# Altium schematic sheet I2C_Keypad_host_module_HID.SchDoc
size B; Author: AM; CompanyName: Expatria Technologies; DrawnBy: A.Marles; Engineer: AM; Organization: Expatria Technologies; DocumentNumber: 13; Revision: A1; SheetNumber: 13; SheetTotal: 14; PCB_Rev: A1
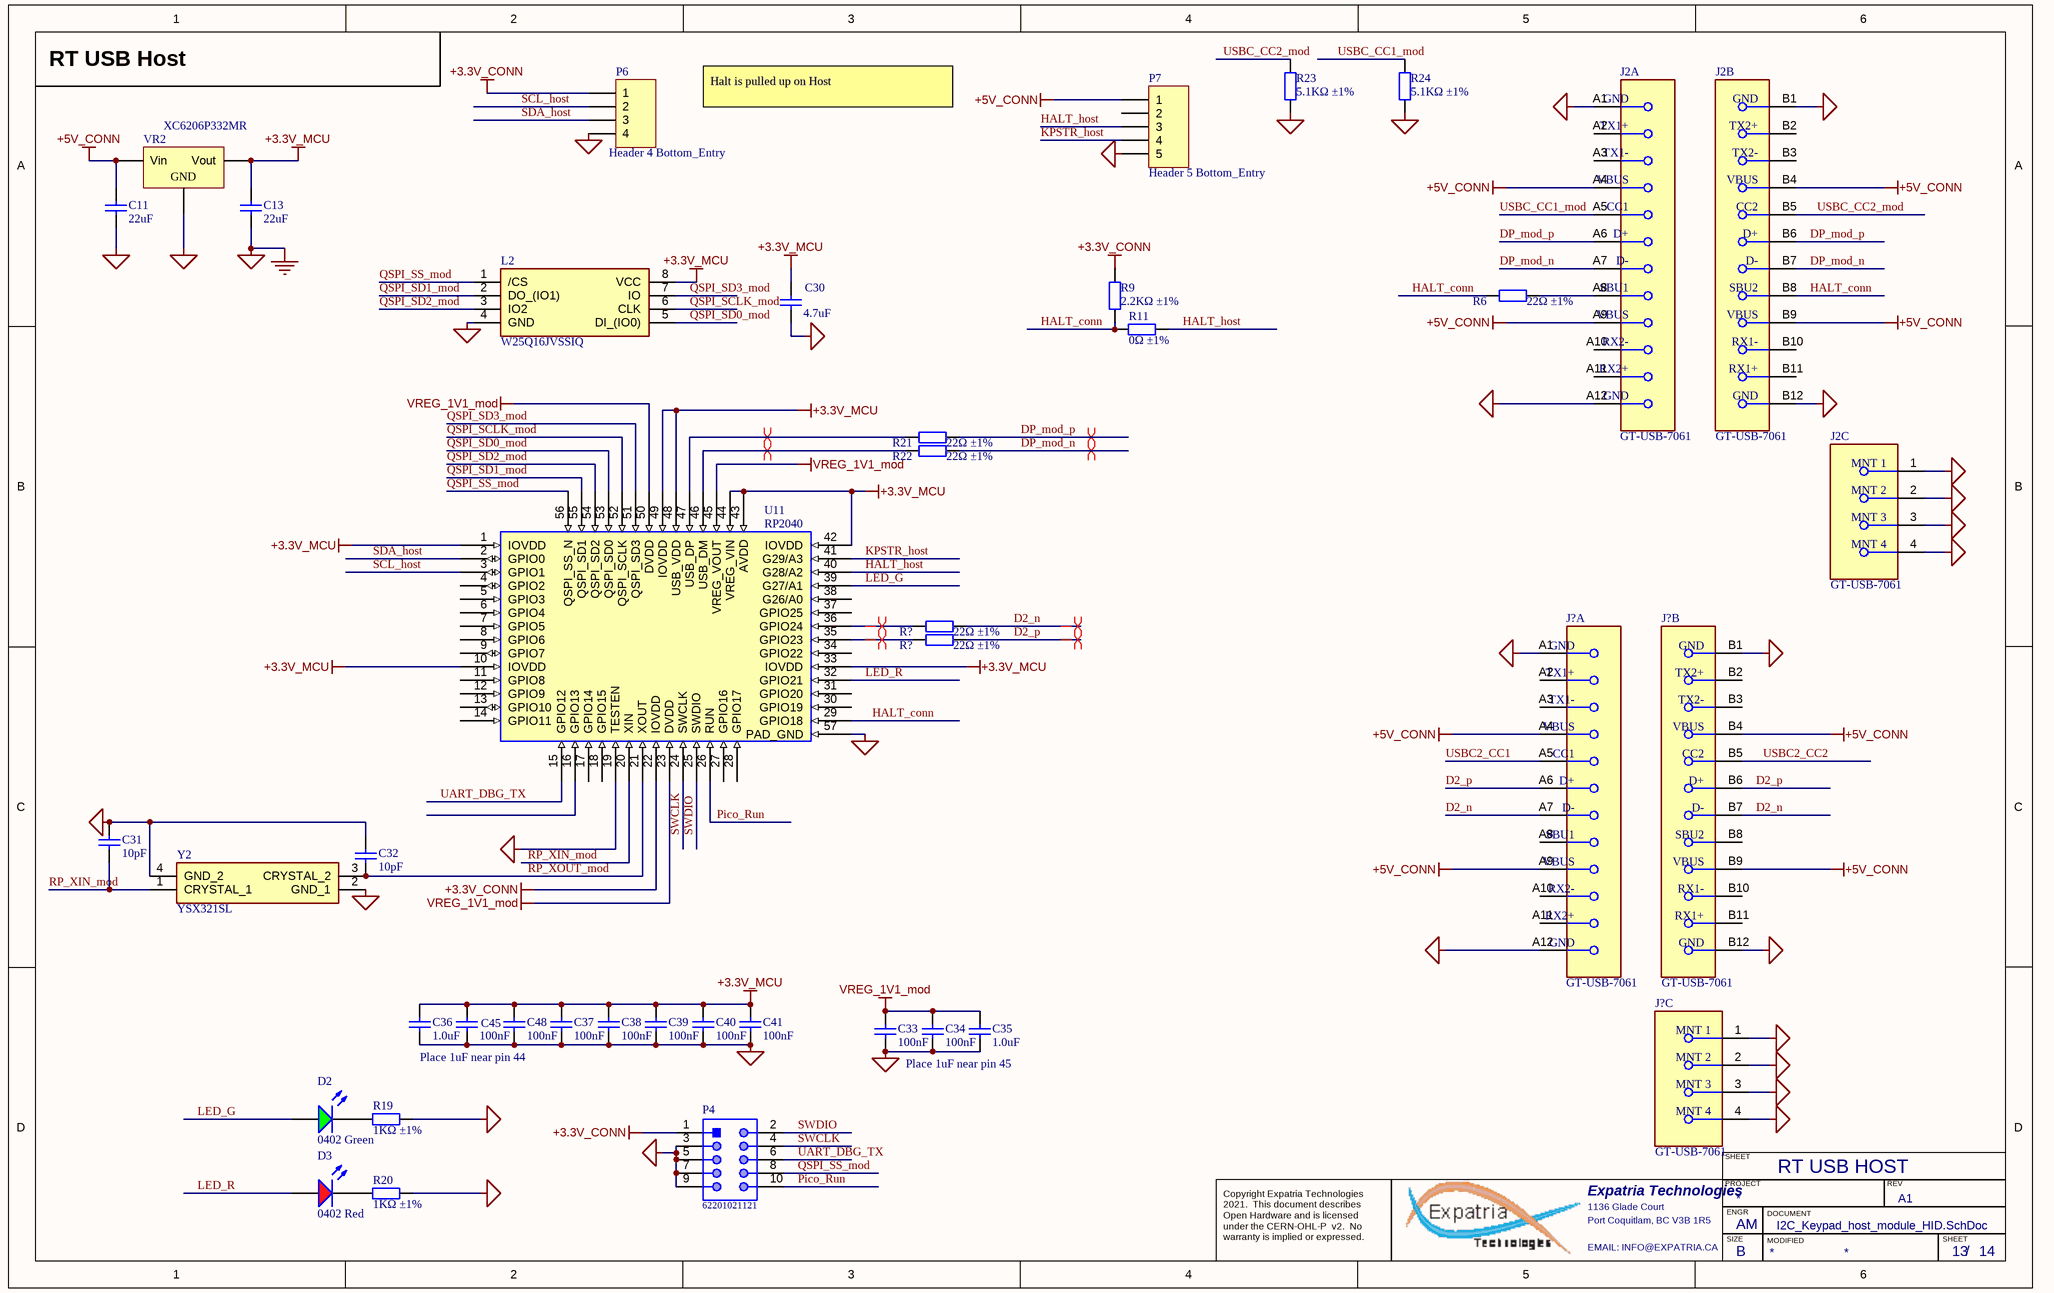
[diagram p0: I2C_Keypad_host_module_HID.SchDoc]

## Parts
(Parts that share a designator on the sheet are numbered #1, #2 ... from top to bottom, then left to right.)
C11  22uF  [0603_C]
C13  22uF  [0603_C]
C30  4.7uF  [0402_C]
C31  10pF  [0402_C]
C32  10pF  [0402_C]
C33  100nF  [0402_C]
C34  100nF  [0402_C]
C35  1.0uF  [0402_C]
C36  1.0uF  [0402_C]
C37  100nF  [0402_C]
C38  100nF  [0402_C]
C39  100nF  [0402_C]
C40  100nF  [0402_C]
C41  100nF  [0402_C]
C45  100nF  [0402_C]
C48  100nF  [0402_C]
D2  0402 Green  [LED 0402_1005 RED]
D3  0402 Red  [LED 0402_1005 RED]
J2  GT-USB-7061  [USB-C-SMD_GT-USB-7061]  (parts A,B,C of 3)
J?#1  GT-USB-7061  [USB-C-SMD_GT-USB-7061]  (part A of 3)
J?#2  GT-USB-7061  [USB-C-SMD_GT-USB-7061]  (part B of 3)
J?#3  GT-USB-7061  [USB-C-SMD_GT-USB-7061]  (part C of 3)
L2  W25Q16JVSSIQ  [SOIC127P780X195-8N]
P4  62201021121  [62201021121]  (no BOM)
P6  Header 4 Bottom_Entry  [NPTC041KFXCRC]  (no BOM)
P7  Header 5 Bottom_Entry  [NPTC051KFXCRC]  (no BOM)
R6  22Ω ±1%  [0402_R]
R9  2.2KΩ ±1%  [0603_R]
R11  0Ω ±1%  [0402_R]  (no BOM)
R19  1KΩ ±1%  [0402_R]
R20  1KΩ ±1%  [0402_R]
R21  22Ω ±1%  [0402_R]
R22  22Ω ±1%  [0402_R]
R23  5.1KΩ ±1%  [0402_R]
R24  5.1KΩ ±1%  [0402_R]
R?#1  22Ω ±1%  [0402_R]
R?#2  22Ω ±1%  [0402_R]
U11  RP2040  [RP2040]
VR2  XC6206P332MR  [SOT-23-3L]
Y2  YSX321SL  [YSX321SL]

## Nets
+3.3V_CONN: P4.1 P6.1 R9.2 U11.22(IOVDD)
+3.3V_MCU: C13.2 C30.2 C36.2 C37.2 C38.2 C39.2 C40.2 C41.2 C45.2 C48.2 L2.8(VCC) U11.1(IOVDD) U11.10(IOVDD) U11.33(IOVDD) U11.42(IOVDD) U11.43(AVDD) U11.44(VREG_VIN) U11.48(USB_VDD) U11.49(IOVDD) VR2.2(Vout)
+5V_CONN: C11.2 J2.A4(VBUS) J2.A9(VBUS) J2.B4(VBUS) J2.B9(VBUS) J?#1.A4(VBUS) J?#1.A9(VBUS) J?#2.B4(VBUS) J?#2.B9(VBUS) P7.1 VR2.3(Vin)
GND: C11.1 C13.1 VR2.1(GND)  [also labelled MCU_GND]
GND_CONN: C30.1 C31.2 C32.2 C33.1 C34.1 C35.1 C36.1 C37.1 C38.1 C39.1 C40.1 C41.1 C45.1 C48.1 J2.1(MNT_1) J2.2(MNT_2) J2.3(MNT_3) J2.4(MNT_4) J2.A1(GND) J2.A12(GND) J2.B1(GND) J2.B12(GND) J?#1.A1(GND) J?#1.A12(GND) J?#2.B1(GND) J?#2.B12(GND) J?#3.1(MNT_1) J?#3.2(MNT_2) J?#3.3(MNT_3) J?#3.4(MNT_4) L2.4(GND) P4.3 P4.5 P4.7 P4.9 P6.4 P7.5 R19.2 R20.2 R23.2 R24.2 U11.19(TESTEN) U11.57(PAD_GND) Y2.2(GND_1) Y2.4(GND_2)
VREG_1V1_mod: C33.2 C34.2 C35.2 U11.23(DVDD) U11.45(VREG_VOUT) U11.50(DVDD)
D2_n: J?#1.A7(D-) J?#2.B7(D-) R?#1.1
D2_p: J?#1.A6(D+) J?#2.B6(D+) R?#2.1
DP_mod_n: J2.A7(D-) J2.B7(D-) R22.1
DP_mod_p: J2.A6(D+) J2.B6(D+) R21.1
HALT_conn: J2.B8(SBU2) R6.2 R9.1 R11.1 U11.29(GPIO18)
HALT_host: P7.3 R11.2 U11.40(G28/A2)
KPSTR_host: P7.4 U11.41(G29/A3)
LED_G: D2.A U11.39(G27/A1)
LED_R: D3.A U11.32(GPIO21)
Pico_Run: P4.10 U11.26(RUN)
QSPI_SCLK_mod: L2.6(CLK) U11.52(QSPI_SCLK)
QSPI_SD0_mod: L2.5(DI_(IO0)) U11.53(QSPI_SD0)
QSPI_SD1_mod: L2.2(DO_(IO1)) U11.55(QSPI_SD1)
QSPI_SD2_mod: L2.3(IO2) U11.54(QSPI_SD2)
QSPI_SD3_mod: L2.7(IO) U11.51(QSPI_SD3)
QSPI_SS_mod: L2.1(/CS) P4.8 U11.56(QSPI_SS_N)
RP_XIN_mod: C31.1 U11.20(XIN) Y2.1(CRYSTAL_1)
RP_XOUT_mod: C32.1 U11.21(XOUT) Y2.3(CRYSTAL_2)
SCL_host: P6.2 U11.3(GPIO1)
SDA_host: P6.3 U11.2(GPIO0)
SWCLK: P4.4 U11.24(SWCLK)
SWDIO: P4.2 U11.25(SWDIO)
UART_DBG_TX: P4.6 U11.15(GPIO12)
USBC2_CC1: J?#1.A5(CC1)
USBC2_CC2: J?#2.B5(CC2)
USBC_CC1_mod: J2.A5(CC1) R24.1
USBC_CC2_mod: J2.B5(CC2) R23.1
NetD2_K: D2.K R19.1
NetD3_K: D3.K R20.1
NetJ2_A8: J2.A8(SBU1) R6.1
NetR21_2: R21.2 U11.47(USB_DP)
NetR22_2: R22.2 U11.46(USB_DM)
NetR?#1_2: R?#1.2 U11.36(GPIO24)
NetR?#2_2: R?#2.2 U11.35(GPIO23)

Not connected (* = marked no-connect by the designer): J2 A2(TX1+) A3(TX1-) A10(RX2-) A11(RX2+) B2(TX2+) B3(TX2-) B10(RX1-) B11(RX1+); J?#1 A2(TX1+) A3(TX1-) A8(SBU1) A10(RX2-) A11(RX2+); J?#2 B2(TX2+) B3(TX2-) B8(SBU2) B10(RX1-) B11(RX1+); P7 2; U11 4(GPIO2) 5(GPIO3) 6(GPIO4) 7(GPIO5) 8(GPIO6) 9(GPIO7) 11(GPIO8) 12(GPIO9) 13(GPIO10) 14(GPIO11) 16(GPIO13) 17(GPIO14) 18(GPIO15) 27(GPIO16) 28(GPIO17) 30(GPIO19) 31(GPIO20) 34(GPIO22) 37(GPIO25) 38(G26/A0)

## Layout directives
differential pair: D2_n, D2_p, DP_mod_n, DP_mod_p, NetR21_2, NetR22_2, NetR?#1_2, NetR?#2_2

## Notes on the sheet
- RT USB Host
- Halt is pulled up on Host
- Place 1uF near pin 44
- Place 1uF near pin 45
- RT USB HOST
- SHEET
- Expatria Technologies
- 1136 Glade Court
- Port Coquitlam, BC V3B 1R5
- PROJECT
- SIZE
- ENGR
- MODIFIED
- DOCUMENT
- REV
- Copyright Expatria Technologies 2021.  This document describes Open Hardware and is licensed under the CERN-OHL-P  v2.  No warranty is implied or expressed.
- EMAIL: INFO@EXPATRIA.CA
- B
- /

## Library data of the parts
C11 C13 = 0603 22uF (226) 20% 6.3V: Chip capacitors; Manufacturer: Samsung Electro-Mechanics; PartNumber: CL10A226MQ8NRNC; Tolerance: 20%; Voltage: 6.3V; Package: 0603; Supplier: LC; SuppliersPartNumber: C59461; Capacitance: 22uF; ComponentLink1Description: Supplier link; ComponentLink1URL: http://www.szlcsc.com/product/details_60514.html
C30 = 0402 4.7uF (475) 20% 10V: Chip capacitor; Manufacturer: Samsung Electro-Mechanics; PartNumber: CL05A475MP5NRNC; Tolerance: 20%; Voltage: 10V; ComponentLink1Description: Supplier link; ComponentLink1URL: http://www.szlcsc.com/product/details_24469.html; Package: 0402; Supplier: LC; SuppliersPartNumber: C23733; Capacitance: 4.7uF
C31 C32 = 0402 10pF (100) 5% 50V: Chip capacitors; Manufacturer: Samsung Electro-Mechanics; PartNumber: CL05C100JB5NNNC; Tolerance: 5%; Voltage: 50V; ComponentLink1Description: Supplier link; ComponentLink1URL: http://www.szlcsc.com/product/details_33914.html; Package: 0402; Supplier: LC; SuppliersPartNumber: C32949; Capacitance: 10pF
C33 C34 C37-C41 C45 C48 = 0402 100nF (104) 10% 16V: Chip capacitors; Manufacturer: Samsung Electro-Mechanics; PartNumber: CL05B104KO5NNNC; Tolerance: 10%; Voltage: 16V; ComponentLink1Description: Supplier link; ComponentLink1URL: http://www.szlcsc.com/product/details_1877.html; Package: 0402; Supplier: LC; SuppliersPartNumber: C1525; Capacitance: 100nF
C35 C36 = 0402 1.0uF (105) 10% 25V: Chip capacitor; Manufacturer: Samsung Electro-Mechanics; PartNumber: CL05A105KA5NQNC; Capacitance: 1uF; Tolerance: 10%; Voltage: 25V; ComponentLink1Description: Supplier link; ComponentLink1URL: http://www.szlcsc.com/product/details_53938.html; Package: 0402; Supplier: LC; SuppliersPartNumber: C52923
D2 = 0402 LED Green: LED; Package: 0402; Supplier: LC; SuppliersPartNumber: C130723; Color: Green
D3 = 0402 LED Red: LED; Package: 0402; Supplier: LC; SuppliersPartNumber: C130720; Color: Red
J2 J?#1-J?#3 = USBC-GT-USB-7061: CONN RCP USB3.1 TYPEC 24P SMD VERT; Manufacturer: G-Switch; Manufacturer Part Number: GT-USB-7061; SuppliersPartNumber: C2762983
L2 = W25Q128JVSIQ_TR: SPI NOR FLASH 16Mbit; Manufacturer_Name: Winbond; Datasheet Link: http://www.winbond.com/resource-files/w25q128jv%20spi%20revc%2011162016.pdf; Height: 1.95mm; Manufacturer_Part_Number: W25Q16JVSSIQ; SuppliersPartNumber: C82317
P4 = CMP-1502-00948-1: THT Vertical Pin Header WR-PHD, Pitch 1.27 mm, Dual Row, 10 pins; Manufacturer: Wurth Elektronik; Rated Current: 1A; Pin Number: 10; Working Voltage: 100VAC; Contact Resistance: 20mOhm; Withstanding Voltage: 500VAC; Pitch: 1.27mm; Gender: Male; Mounting Technology: THT; Manufacturer URL: http://www.we-online.de; Package Reference: 62201021121; Row Number: Dual; Datasheet URL: https://katalog.we-online.de/em/datasheet/62201021121.pdf; Publisher: WurthElektronik; Packaging: Box; Operating Temperature: -40to105degC; Orientation: Vertical; Part Number: 62201021121
P6 = Header 4: Header, 4-Pin; Manufacturer: Sullins; Publisher: Altium Limited; Manufacturer_Part_Number: NPTC041KFXCRC
P7 = Header 5: Header, 5-Pin; Manufacturer: Sullins; Manufacturer_Part_Number: NPTC051KFXCRC
R6 R21 R22 R?#1 R?#2 = 0402 22R (22R0) 1%: Chip resistor; Manufacturer: Uniroyal Elec; PartNumber: 0402WGF220JTCE; Power: 1/16W; ComponentLink1Description: Supplier link; ComponentLink1URL: http://www.szlcsc.com/product/details_25835.html; Package: 0402; Supplier: LC; SuppliersPartNumber: C25092; Resistance: 22Ω; Tolerance: 1%
R9 = 0603 2.2K (2201) 1%: Chip resistor; Manufacturer: Uniroyal Elec; PartNumber: 0603WAF2201T5E; Power: 1/10W; ComponentLink1Description: Supplier link; ComponentLink1URL: http://www.szlcsc.com/product/details_4597.html; Package: 0603; Supplier: LC; SuppliersPartNumber: C4190; Resistance: 2.2KΩ; Tolerance: 1%
R11 = 0402 0R (0R0) 1%: Chip resistor; Manufacturer: Uniroyal Elec; PartNumber: 0402WGF0000TCE; Power: 1/16W; ComponentLink1Description: Supplier link; ComponentLink1URL: http://www.szlcsc.com/product/details_17853.html; Package: 0402; Supplier: LC; SuppliersPartNumber: C17168; Resistance: 0Ω; Tolerance: 1%
R19 R20 = 0402 1K (1001) 1%: Chip resistor; Manufacturer: Uniroyal Elec; PartNumber: 0402WGF1001TCE; Power: 1/16W; ComponentLink1Description: Supplier link; ComponentLink1URL: http://www.szlcsc.com/product/details_12256.html; Package: 0402; Supplier: LC; SuppliersPartNumber: C11702; Resistance: 1KΩ; Tolerance: 1%
R23 R24 = 0402 5.1K (5101) 1%: Chip resistor; Manufacturer: Uniroyal Elec; PartNumber: 0402WGF5101TCE; Power: 1/16W; Resistance: 51.1KΩ; ComponentLink1Description: Supplier link; ComponentLink1URL: http://www.szlcsc.com/product/details_26648.html; Package: 0402; Supplier: LC; SuppliersPartNumber: C25905; Tolerance: 1%
U11 = RP2040: RP2040 First MCU from RPI
VR2 = SOT-23 XC6206P332MR: 200mA 680mV@(100mA) Fixed 3.3V~3.3V Positive 1 6V SOT-23-3L Linear Voltage Regulators (LDO) ROHS; ComponentLink1Description: 供应商链接; ComponentLink1URL: http://www.szlcsc.com/product/details_5896.html; Package: SOT-23; Supplier: LC; SuppliersPartNumber: C5446
Y2 = YSX321SL: Crystal or Oscillator; Manufacturer_Name: YXC; Datasheet Link: https://datasheet.lcsc.com/szlcsc/YSX321SL-30MHZ-10PF-8PPM_C70576.pdf; Height: 0.8mm; Manufacturer_Part_Number: YSX321SL; SuppliersPartNumber: C9002